# Altium schematic sheet [06] - PROTOCOLS.SchDoc
size A3; DocumentNumber: 4; SheetNumber: 4; SheetTotal: 6
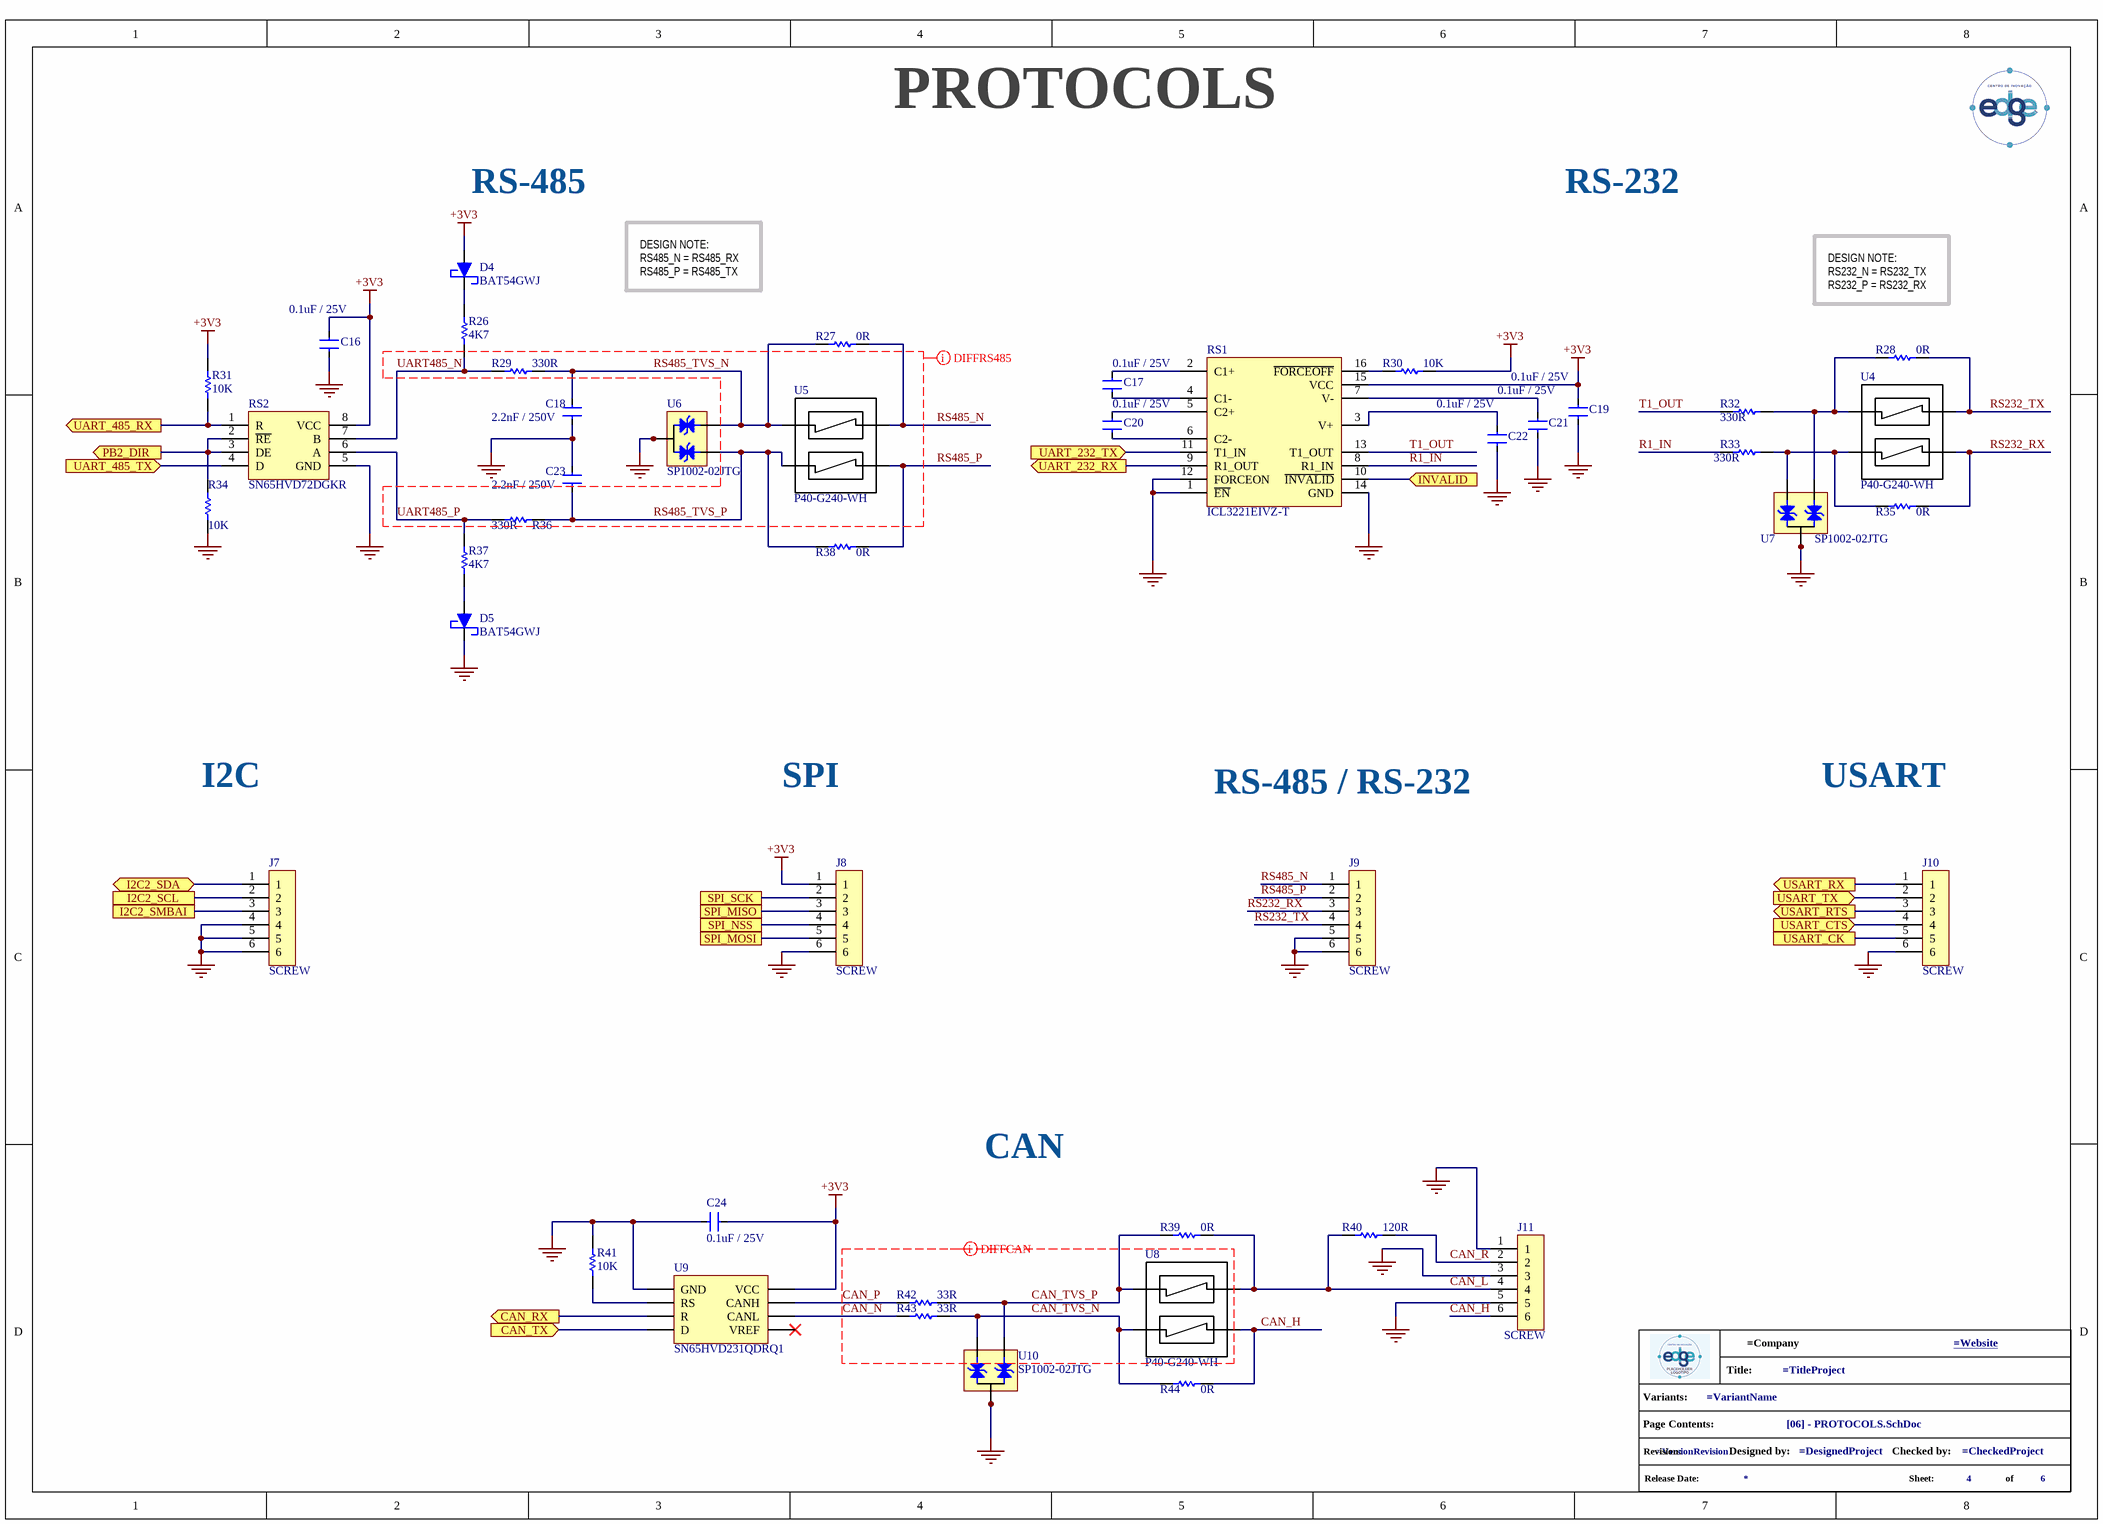
[diagram p0: [06] - PROTOCOLS.SchDoc]

## Parts
*?  info_project  (value not drawn)  (graphical)
C16  0.1uF / 25V  [C0805]
C17  0.1uF / 25V  [C0805]
C18  2.2nF / 250V  [C0805]
C19  0.1uF / 25V  [C0805]
C20  0.1uF / 25V  [C0805]
C21  0.1uF / 25V  [C0805]
C22  0.1uF / 25V  [C0805]
C23  2.2nF / 250V  [C0805]
C24  0.1uF / 25V  [C0805]
D4  BAT54GWJ  [SOD123]
D5  BAT54GWJ  [SOD123]
J7  SCREW  [SCREW-6P]
J8  SCREW  [SCREW-6P]
J9  SCREW  [SCREW-6P]
J10  SCREW  [SCREW-6P]
J11  SCREW  [SCREW-6P]
R26  4K7  [R0805]
R27  0R  [R1206]
R28  0R  [R1206]
R29  330R  [R0805]
R30  10K  [R0805]
R31  10K  [R0805]
R32  330R  [R0805]
R33  330R  [R0805]
R34  10K  [R0805]
R35  0R  [R1206]
R36  330R  [R0805]
R37  4K7  [R0805]
R38  0R  [R1206]
R39  0R  [R1206]
R40  120R  [R0805]
R41  10K  [R0805]
R42  33R  [R0805]
R43  33R  [R0805]
R44  0R  [R1206]
RS1  ICL3221EIVZ-T  [ICL3221E]
RS2  SN65HVD72DGKR  [RS485T]
U4  P40-G240-WH  [TBU - P40-G240-WH]
U5  P40-G240-WH  [TBU - P40-G240-WH]
U6  SP1002-02JTG  [SC705]
U7  SP1002-02JTG  [SC705]
U8  P40-G240-WH  [TBU - P40-G240-WH]
U9  SN65HVD231QDRQ1  [SN65HVD231QDRQ1]
U10  SP1002-02JTG  [SC705]

## Ports
CAN_RX (out), CAN_TX (in), I2C2_SCL, I2C2_SDA (bidir), I2C2_SMBAI, INVALID (in), PB2_DIR (out), SPI_MISO, SPI_MOSI, SPI_NSS, SPI_SCK, UART_232_RX (out), UART_232_TX (in), UART_485_RX (out), UART_485_TX (in), USART_CK, USART_CTS (in), USART_RTS (out), USART_RX (out), USART_TX (in)

## Nets
+3V3: C16.2 C19.1 C24.1 D4.2 J8.1 R30.2 R31.2 RS1.15(VCC) RS2.8(VCC) U9.3(VCC)
GND: C16.1 C18.1 C19.2 C21.2 C22.1 C23.2 C24.2 D5.1 J7.4 J7.5 J7.6 J8.6 J9.5 J9.6 J10.6 J11.1 J11.3 J11.5 R34.1 R41.1 RS1.1(~{EN}) RS1.12(FORCEON) RS1.14(GND) RS2.5(GND) U6.4 U6.5 U7.4 U7.5 U9.2(GND) U10.4 U10.5
CAN_H: J11.6 R44.2 U8.4
CAN_L: J11.4 R39.2 R40.1 U8.3
CAN_N: R43.1 U9.6(CANL)
CAN_P: R42.1 U9.7(CANH)
CAN_R: J11.2 R40.2
CAN_RX: U9.4(R) ; port CAN_RX
CAN_TVS_N: R43.2 R44.1 U8.2 U10.3
CAN_TVS_P: R39.1 R42.2 U8.1 U10.1
CAN_TX: U9.1(D) ; port CAN_TX
I2C2_SCL: J7.2 ; port I2C2_SCL
I2C2_SDA: J7.1 ; port I2C2_SDA
I2C2_SMBAI: J7.3 ; port I2C2_SMBAI
INVALID: RS1.10(~{INVALID}) ; port INVALID
PB2_DIR: R34.2 RS2.2(~{RE}) RS2.3(DE) ; port PB2_DIR
R1_IN: R33.1 RS1.8(R1_IN)
RS232_RX: J9.3 R35.2 U4.4
RS232_TX: J9.4 R28.2 U4.3
RS485_N: J9.1 R27.2 U5.3
RS485_P: J9.2 R38.2 U5.4
RS485_TVS_N: C18.2 R27.1 R29.2 U5.1 U6.3
RS485_TVS_P: C23.1 R36.2 R38.1 U5.2 U6.1
SPI_MISO: J8.3 ; port SPI_MISO
SPI_MOSI: J8.5 ; port SPI_MOSI
SPI_NSS: J8.4 ; port SPI_NSS
SPI_SCK: J8.2 ; port SPI_SCK
T1_OUT: R32.1 RS1.13(T1_OUT)
UART485_N: R26.1 R29.1 RS2.7(B)
UART485_P: R36.1 R37.2 RS2.6(A)
UART_232_RX: RS1.9(R1_OUT) ; port UART_232_RX
UART_232_TX: RS1.11(T1_IN) ; port UART_232_TX
UART_485_RX: R31.1 RS2.1(R) ; port UART_485_RX
UART_485_TX: RS2.4(D) ; port UART_485_TX
USART_CK: J10.5 ; port USART_CK
USART_CTS: J10.4 ; port USART_CTS
USART_RTS: J10.3 ; port USART_RTS
USART_RX: J10.1 ; port USART_RX
USART_TX: J10.2 ; port USART_TX
NetC17_1: C17.1 RS1.4(C1-)
NetC17_2: C17.2 RS1.2(C1+)
NetC20_1: C20.1 RS1.6(C2-)
NetC20_2: C20.2 RS1.5(C2+)
NetC21_1: C21.1 RS1.7(V-)
NetC22_2: C22.2 RS1.3(V+)
NetD4_1: D4.1 R26.2
NetD5_2: D5.2 R37.1
NetR28_1: R28.1 R32.2 U4.1 U7.1
NetR30_1: R30.1 RS1.16(~{FORCEOFF})
NetR33_2: R33.2 R35.1 U4.2 U7.3
NetR41_2: R41.2 U9.8(RS)

Not connected (* = marked no-connect by the designer): U9 5(VREF)*

## Layout directives
differential pair; net class CAN; differential pair class CAN_LINES; differential pair class CAN_TVS_LINES: CAN_N, CAN_P, CAN_TVS_N, CAN_TVS_P
differential pair; net class RS485; differential pair class RS485_LINES; differential pair class RS485_TVS_LINES: RS485_TVS_N, RS485_TVS_P, UART485_N, UART485_P

## Notes on the sheet
- PROTOCOLS
- RS-485
- RS-232
- DESIGN NOTE:
  RS485_N = RS485_RX
  RS485_P = RS485_TX
- DESIGN NOTE:
  RS232_N = RS232_TX
  RS232_P = RS232_RX
- I2C
- SPI
- RS-485 / RS-232
- USART
- CAN
- (in symbol info_project) Title:; Variants:; Page Contents:; Revision:; Designed by:; Checked by:; Release Date:; Sheet:; of

## Library data of the parts
C16 C17 C19-C22 C24 = CC0805KRX7R8BB104: MLCC - 0.1uF 25V 0805 X7R +/- 10%; Manufacturer: Yageo; Material: Ceramic; Capacitance: 100nF; Insulation Resistance: 100GR; Supplier 1: Digi-Key; Manufacturer Part Number: CC0805KRX7R8BB104; RoHS: Yes; Category: Ceramic Capacitors; Stock 1: 331734; Pricing 1: 1=0,12000, 10=0,08800, 50=0,04980, 100=0,04130, 500=0,02894, 1000=0,02396 (USD); Mount: Surface Mount; Case/Package: 0805; Number of Pins: 2; Case Code (Metric): 2012; Case Code (Imperial): 0805; Min Operating Temperature: -55°C; Max Operating Temperature: 125°C; Tolerance: 10%; Dielectric: X7R; Series: CC; Package Quantity: 1; Voltage Rating: 25V; Packaging: Tape and Reel; Voltage Rating (DC): 25V; Termination: SMD/SMT; Resistor Type: Ceramic; Length: 2mm; Width: 0.049inch; Height: 0.85mm; Depth: 1.25mm; Thickness: 0.033inch; Radiation Hardening: No; RoHS Compliant: Yes; REACH SVHC: No SVHC; Lead Free: Lead Free; Halogen Free: Halogen Free; ComponentLink1URL: https://datasheet.ciiva.com/145/mlccorderingcode-145007.pdf?src-supplier=Digi-Key; ComponentLink1Description: https://datasheet.ciiva.com/145/mlccorderingcode-145007.pdf?src-supplier=Digi-Key; ComponentLink2URL: https://datasheet.ciiva.com/145/mlccorderingcode-145008.pdf?src-supplier=Digi-Key; ComponentLink2Description: https://datasheet.ciiva.com/145/mlccorderingcode-145008.pdf?src-supplier=Digi-Key; ComponentLink3URL: https://datasheet.ciiva.com/145/mlccorderingcode-145009.pdf?src-supplier=Digi-Key; ComponentLink3Description: https://datasheet.ciiva.com/145/mlccorderingcode-145009.pdf?src-supplier=Digi-Key; ComponentLink4URL: https://datasheet.ciiva.com/8034/1784427-8034029.pdf?src-supplier=Element14; ComponentLink4Description: https://datasheet.ciiva.com/8034/1784427-8034029.pdf?src-supplier=Element14; ComponentLink5URL: https://datasheet.ciiva.com/8034/1784427-8034030.pdf?src-supplier=Element14; ComponentLink5Description: https://datasheet.ciiva.com/8034/1784427-8034030.pdf?src-supplier=Element14; ComponentLink6URL: https://datasheet.ciiva.com/8034/70765-8034031.pdf?src-supplier=Element14; ComponentLink6Description: https://datasheet.ciiva.com/8034/70765-8034031.pdf?src-supplier=Element14; ComponentLink7URL: https://datasheet.ciiva.com/46430/1850775-46430166.pdf?src-supplier=Element14; ComponentLink7Description: https://datasheet.ciiva.com/46430/1850775-46430166.pdf?src-supplier=Element14; ComponentLink8URL: https://datasheet.ciiva.com/28450/1489800-28450789.pdf?src-supplier=Element14; ComponentLink8Description: https://datasheet.ciiva.com/28450/1489800-28450789.pdf?src-supplier=Element14; ComponentLink9URL: https://datasheet.ciiva.com/15189/getdatasheetpartid-330244-15189223.pdf?src-supplier=Verical; ComponentLink9Description: https://datasheet.ciiva.com/15189/getdatasheetpartid-330244-15189223.pdf?src-supplier=Verical; ComponentLink10URL: https://datasheet.ciiva.com/16625/upy-gphc-x7r-6-3v-to-50v-8-16625546.pdf?src-supplier=Avnet+Europe; ComponentLink10Description: https://datasheet.ciiva.com/16625/upy-gphc-x7r-6-3v-to-50v-8-16625546.pdf?src-supplier=Avnet+Europe; Supplier Part Number 1: 311-1141-1-ND
C18 C23 = C0805C222KAGECAUTO: MLCC - 2.2 nF 250V 0805  C0G +/- 10%; Manufacturer: KEMET; Supplier 1: Digi-Key; Manufacturer Part Number: C0805C222KAGECAUTO; RoHS: Yes; Category: Ceramic Capacitors; Stock 1: 14146; Pricing 1: 1=0,26000, 10=0,17800, 50=0,11880, 100=0,10100, 500=0,07128, 1000=0,06237 (USD); RoHS Compliant: Yes; ComponentLink1URL: https://api.kemet.com/component-edge/download/datasheet/C0805C222KAGECAUTO.pdf?src-supplier=Digi-Key; ComponentLink1Description: https://api.kemet.com/component-edge/download/datasheet/C0805C222KAGECAUTO.pdf?src-supplier=Digi-Key; Supplier Part Number 1: 399-17905-1-ND
D4 D5 = BAT54GWJ: DIODE SCHOTTKY 30 V - 200 mA SOD123; Manufacturer: Nexperia USA; Max Reverse Voltage (DC): 30V; Average Rectified Current: 200mA; Supplier 1: Newark; Manufacturer Part Number: BAT54GWJ; RoHS: No; Mount: Surface Mount; Min Operating Temperature: -40°C; Max Operating Temperature: 85°C; Packaging: Cut Tape; ComponentLink1URL: https://assets.nexperia.com/documents/data-sheet/BAT54GW.pdf?src-supplier=Digi-Key; ComponentLink1Description: https://assets.nexperia.com/documents/data-sheet/BAT54GW.pdf?src-supplier=Digi-Key; Supplier Part Number 1: 73AH9681
J7-J11 = 282834-6: TERM BLK 6P SIDE 2.54MM; Manufacturer: TE Connectivity; Plating: Brass,Steel; Number of Contacts: 6; Current Rating: 10A; Voltage Rating: 150V; Number of Levels: 1; Connector Type: Receptacle; Closed End: No (Without); Screwless Terminal Block: Yes (With); Gender: Female; Wire Gauge (Max): 30AWG; Wire Gauge (Min): 16AWG; Thread Size: M1.6; Tail Length: 3.4mm; Approvals: UL; Supplier 1: Digi-Key; Manufacturer Part Number: 282834-6; RoHS: Yes; Category: Terminal Blocks; Stock 1: 7269; Pricing 1: 1=5,33000, 10=4,06500, 25=3,80720, 50=3,38400, 100=3,31050, 250=3,05300, 500=2,75874, 1000=2,45221 (USD); Mount: Through Hole; Color: Green; Contact Plating: Tin; Contact Material: Brass; Housing Color: Green; Housing Material: Polyamide; Material: Nylon; Min Operating Temperature: -40°C; Max Operating Temperature: 105°C; Termination: Solder; Orientation: Straight; Package Quantity: 100; Packaging: Box; Number of Rows: 1; Series: Buchanan; Number of Positions Per Level: 6; Current: 10A; Voltage: 150V; Number of Positions: 6; Number of Circuits: 6; Max Current Rating: 10A; Interlock: No (Without); Screw Flange: No (Without); Side Stackable: Yes (With); Max Supply Voltage (AC): 150V; Number of Poles: 6; Max Voltage Rating (AC): 150V; Length: 15.7mm; Width: 6.5mm; Pitch: 2.54mm; Depth: 6.5mm; Wire/Cable Gauge: 30AWG; Radiation Hardening: No; Flammability Rating: UL94 V-0; ELV: Compliant; REACH SVHC: Unknown; Lead Free: Lead Free; ComponentLink1URL: https://datasheet.ciiva.com/823/eng-cd-282834-c1-823488.pdf?src-supplier=Digi-Key; ComponentLink1Description: https://datasheet.ciiva.com/823/eng-cd-282834-c1-823488.pdf?src-supplier=Digi-Key; ComponentLink2URL: https://datasheet.ciiva.com/16308/282834-6-16308413.pdf?src-supplier=Future+Electronics; ComponentLink2Description: https://datasheet.ciiva.com/16308/282834-6-16308413.pdf?src-supplier=Future+Electronics; ComponentLink3URL: https://datasheet.ciiva.com/25618/0900766b810c7187-25618156.pdf?src-supplier=RSComponents; ComponentLink3Description: https://datasheet.ciiva.com/25618/0900766b810c7187-25618156.pdf?src-supplier=RSComponents; ComponentLink4URL: https://datasheet.ciiva.com/9370/eng-cs-1308389-eurostyle-terminal-blocks-0607-9370422.pdf?src-supplier=Avnet; ComponentLink4Description: https://datasheet.ciiva.com/9370/eng-cs-1308389-eurostyle-terminal-blocks-0607-9370422.pdf?src-supplier=Avnet; ComponentLink5URL: https://datasheet.ciiva.com/16676/eng-cs-1308389-eurostyle-terminal-blocks-0607-16676062.pdf?src-supplier=Avnet+Europe; ComponentLink5Description: https://datasheet.ciiva.com/16676/eng-cs-1308389-eurostyle-terminal-blocks-0607-16676062.pdf?src-supplier=Avnet+Europe; ComponentLink6URL: https://datasheet.ciiva.com/30097/eng-cs-1308389-eurostyle-terminal-blocks-0607-30097352.pdf?src-supplier=Onlinecomponents.com; ComponentLink6Description: https://datasheet.ciiva.com/30097/eng-cs-1308389-eurostyle-terminal-blocks-0607-30097352.pdf?src-supplier=Onlinecomponents.com; Supplier Part Number 1: A98337-ND
R26 R37 = CRCW08054K70FKEA: RES - 4.7K 1/8W 0805 1%; Manufacturer: Vishay; Resistance: 4.7kR; Power Rating: 125mW; Temperature Coefficient: 100ppm/°C; Voltage Rating: 150V; Supplier 1: RSComponents; Manufacturer Part Number: CRCW08054K70FKEA; RoHS: Yes; Category: Chip SMD Resistors; Stock 1: 1; Pricing 1: 50=0.07500, 250=0.06800, 500=0.05500, 750=0.04400, 1000=0.03700 (USD); Case/Package: 0805; Contact Plating: Tin; Weight: 0.000194oz; Case Code (Imperial): 0805; Case Code (Metric): 2012; Size Code: 0805; Min Operating Temperature: -55°C; Max Operating Temperature: 155°C; Tolerance: 1%; Resistor Type: Thick Film; Termination: SMD/SMT; Packaging: Tape and Reel; Package Quantity: 10; Number of Terminations: 2; Max Power Dissipation: 125mW; Voltage Rating (DC): 150V; Features: Automotive AEC-Q200; Series: CRCW; Resistance Tolerance: 1%; Technology: THICK FILM; Construction: Rectangular; Length: 2mm; Width: 1.25mm; Height: 0.45mm; Depth: 1.25mm; Radiation Hardening: No; Lead Free: Lead Free; RoHS Compliant: Yes; REACH SVHC: Unknown; Military Standard: Not; ComponentLink1URL: https://datasheet.ciiva.com/11808/0900766b80d98b26-11808992.pdf?src-supplier=RSComponents; ComponentLink1Description: https://datasheet.ciiva.com/11808/0900766b80d98b26-11808992.pdf?src-supplier=RSComponents; ComponentLink2URL: https://datasheet.ciiva.com/2467/dcrcwe3-2467437.pdf?src-supplier=Digi-Key; ComponentLink2Description: https://datasheet.ciiva.com/2467/dcrcwe3-2467437.pdf?src-supplier=Digi-Key; ComponentLink3URL: https://datasheet.ciiva.com/2467/dcrcwe3-2467438.pdf?src-supplier=Digi-Key; ComponentLink3Description: https://datasheet.ciiva.com/2467/dcrcwe3-2467438.pdf?src-supplier=Digi-Key; ComponentLink4URL: https://datasheet.ciiva.com/2467/dcrcwe3-2467439.pdf?src-supplier=Digi-Key; ComponentLink4Description: https://datasheet.ciiva.com/2467/dcrcwe3-2467439.pdf?src-supplier=Digi-Key; ComponentLink5URL: https://datasheet.ciiva.com/5550/dcrcwe3-109170-5550903.pdf?src-supplier=Mouser; ComponentLink5Description: https://datasheet.ciiva.com/5550/dcrcwe3-109170-5550903.pdf?src-supplier=Mouser; ComponentLink6URL: https://datasheet.ciiva.com/9071/dcrcwe3-9071196.pdf?src-supplier=Avnet; ComponentLink6Description: https://datasheet.ciiva.com/9071/dcrcwe3-9071196.pdf?src-supplier=Avnet; ComponentLink7URL: https://datasheet.ciiva.com/26317/fld-crcw-e3-data-en-26317145.pdf?src-supplier=Distrelec; ComponentLink7Description: https://datasheet.ciiva.com/26317/fld-crcw-e3-data-en-26317145.pdf?src-supplier=Distrelec; ComponentLink8URL: https://datasheet.ciiva.com/16213/dcrcwe3-16213733.pdf?src-supplier=Future+Electronics; ComponentLink8Description: https://datasheet.ciiva.com/16213/dcrcwe3-16213733.pdf?src-supplier=Future+Electronics; ComponentLink9URL: https://datasheet.ciiva.com/16720/70201119-16720438.pdf?src-supplier=Allied+Electronics; ComponentLink9Description: https://datasheet.ciiva.com/16720/70201119-16720438.pdf?src-supplier=Allied+Electronics; Supplier Part Number 1: 6791496P
R27 R28 R35 R38 R39 R44 = RC1206JR-070RL: RES - 0R 1/4W 1206 5%; Manufacturer: Yageo; Resistance: 0mR; Power Rating: 250mW; Voltage Rating: 200V; Temperature Coefficient: 200ppm/°C; Supplier 1: Digi-Key; Manufacturer Part Number: RC1206JR-070RL; RoHS: Yes; Category: Chip SMD Resistors; Stock 1: 6773822; Pricing 1: 1=0.10000, 10=0.05500, 25=0.04000, 50=0.03040, 100=0.02240, 250=0.01712, 500=0.01368, 1000=0.01007 (USD); Case/Package: 1206; Contact Plating: Tin,Matte; Case Code (Metric): 3216; Case Code (Imperial): 1206; Size Code: 1206; Min Operating Temperature: -55°C; Max Operating Temperature: 155°C; Resistor Type: Thick Film,Carbon Film; Tolerance: 5%; Packaging: Tape and Reel; Package Quantity: 5000; Number of Terminations: 2; Termination: SMD/SMT; Max Power Dissipation: 250mW; Series: RC1206; Resistance Tolerance: 5%; Construction: Rectangular; Technology: THICK FILM; Length: 3.1mm; Width: 0.063inch; Height: 0.026inch; Depth: 1.6mm; Radiation Hardening: No; REACH SVHC: Unknown; Military Standard: Not; Lead Free: Lead Free; RoHS Compliant: Yes; ComponentLink1URL: https://datasheet.ciiva.com/11808/0900766b80c6630a-11808156.pdf?src-supplier=RSComponents; ComponentLink1Description: https://datasheet.ciiva.com/11808/0900766b80c6630a-11808156.pdf?src-supplier=RSComponents; ComponentLink2URL: https://datasheet.ciiva.com/29181/402222-da-01-en-smd-widerstand-0-ohm-1206-29181568.pdf?src-supplier=Conrad; ComponentLink2Description: https://datasheet.ciiva.com/29181/402222-da-01-en-smd-widerstand-0-ohm-1206-29181568.pdf?src-supplier=Conrad; ComponentLink3URL: https://datasheet.ciiva.com/2458/pyu-rc1206-51-rohs-l-4-2458668.pdf?src-supplier=Digi-Key; ComponentLink3Description: https://datasheet.ciiva.com/2458/pyu-rc1206-51-rohs-l-4-2458668.pdf?src-supplier=Digi-Key; ComponentLink4URL: https://datasheet.ciiva.com/2458/pyu-rc1206-51-rohs-l-4-2458669.pdf?src-supplier=Digi-Key; ComponentLink4Description: https://datasheet.ciiva.com/2458/pyu-rc1206-51-rohs-l-4-2458669.pdf?src-supplier=Digi-Key; ComponentLink5URL: https://datasheet.ciiva.com/2458/pyu-rc1206-51-rohs-l-4-2458670.pdf?src-supplier=Digi-Key; ComponentLink5Description: https://datasheet.ciiva.com/2458/pyu-rc1206-51-rohs-l-4-2458670.pdf?src-supplier=Digi-Key; ComponentLink6URL: https://datasheet.ciiva.com/7857/1692832-7857421.pdf?src-supplier=Element14; ComponentLink6Description: https://datasheet.ciiva.com/7857/1692832-7857421.pdf?src-supplier=Element14; ComponentLink7URL: https://datasheet.ciiva.com/17035/pyu-rc1206-51-rohs-l-4-17035512.pdf?src-supplier=Future+Electronics; ComponentLink7Description: https://datasheet.ciiva.com/17035/pyu-rc1206-51-rohs-l-4-17035512.pdf?src-supplier=Future+Electronics; ComponentLink8URL: https://datasheet.ciiva.com/46445/444357-46445719.pdf?src-supplier=Element14; ComponentLink8Description: https://datasheet.ciiva.com/46445/444357-46445719.pdf?src-supplier=Element14; ComponentLink9URL: https://datasheet.ciiva.com/7857/1692832-7857422.pdf?src-supplier=Element14; ComponentLink9Description: https://datasheet.ciiva.com/7857/1692832-7857422.pdf?src-supplier=Element14; ComponentLink10URL: https://datasheet.ciiva.com/7983/444357-7983807.pdf?src-supplier=Element14; ComponentLink10Description: https://datasheet.ciiva.com/7983/444357-7983807.pdf?src-supplier=Element14; ComponentLink11URL: https://datasheet.ciiva.com/22747/1692832-22747541.pdf?src-supplier=Element14; ComponentLink11Description: https://datasheet.ciiva.com/22747/1692832-22747541.pdf?src-supplier=Element14; Supplier Part Number 1: 311-0.0ERCT-ND
R29 R32 R33 R36 = RMCF0805JT330R: RES - 330R 1/8W 0805 5%; Manufacturer: Stackpole Electronics; Power Rating: 125mW; Temperature Coefficient: 200ppm/°C; Supplier 1: Digi-Key; Manufacturer Part Number: RMCF0805JT330R; RoHS: Yes; Category: Chip SMD Resistors; Stock 1: 260111; Pricing 1: 1=0,10000, 10=0,02000, 100=0,00810, 1000=0,00366, 2500=0,00318 (USD); Mount: Surface Mount; Case/Package: 0805; Case Code (Metric): 2012; Case Code (Imperial): 0805; Contact Plating: Tin,Matte; Size Code: 0805; Min Operating Temperature: -55°C; Max Operating Temperature: 155°C; Packaging: Tape and Reel; Resistance: 330R; Tolerance: 5%; Resistor Type: Thick Film; Number of Terminations: 2; Max Power Dissipation: 125mW; Features: Automotive AEC-Q200; Series: RMCF; Construction: Rectangular; Length: 2mm; Width: 0.049inch; Height: 0.026inch; Depth: 1.25mm; Radiation Hardening: No; Military Standard: Not; Lead Free: Lead Free; RoHS Compliant: Yes; ComponentLink1URL: http://components.arrow.com/part/dataview/44988371S7054774N1174?src-supplier=Arrow+Electronics; ComponentLink1Description: http://components.arrow.com/part/dataview/44988371S7054774N1174?src-supplier=Arrow+Electronics; ComponentLink2URL: https://www.seielect.com/catalog/SEI-Packaging.pdf?src-supplier=Digi-Key; ComponentLink2Description: https://www.seielect.com/catalog/SEI-Packaging.pdf?src-supplier=Digi-Key; ComponentLink3URL: https://www.seielect.com/Catalog/SEI-RMCF_RMCP.pdf?src-supplier=Avnet; ComponentLink3Description: https://www.seielect.com/Catalog/SEI-RMCF_RMCP.pdf?src-supplier=Avnet; ComponentLink4URL: https://www.verical.com/server-webapp/html/getDatasheet?partID=360139&src-supplier=Verical; ComponentLink4Description: https://www.verical.com/server-webapp/html/getDatasheet?partID=360139&src-supplier=Verical; ComponentLink5URL: http://www.seielect.com/Catalog/SEI-RMC.pdf?src-supplier=Future+Electronics; ComponentLink5Description: http://www.seielect.com/Catalog/SEI-RMC.pdf?src-supplier=Future+Electronics; Supplier Part Number 1: RMCF0805JT330RCT-ND
R30 R31 R34 R41 = RC0805FR-0710KL: RES - 10K  1/8W 0805 1%; Manufacturer: Yageo; Resistance: 10kR; Temperature Coefficient: 100ppm/°C; Power Rating: 125mW; Voltage Rating: 150V; Supplier 1: Digi-Key; Manufacturer Part Number: RC0805FR-0710KL; RoHS: Yes; Category: Chip SMD Resistors; Stock 1: 5866675; Pricing 1: 1=0,10000, 10=0,04200, 100=0,01690, 1000=0,00759, 2500=0,00659 (USD); Case/Package: 0805; Case Code (Imperial): 0805; Case Code (Metric): 2012; Size Code: 0805; Min Operating Temperature: -55°C; Max Operating Temperature: 155°C; Tolerance: 1%; Resistor Type: Thick Film; Packaging: Tape and Reel; Package Quantity: 1; Termination: SMD/SMT; Number of Terminations: 2; Max Power Dissipation: 125mW; Features: Moisture Resistant; Series: RC; Construction: Rectangular; Resistance Tolerance: 1%; Technology: THICK FILM; Length: 2mm; Width: 0.049inch; Height: 0.024inch; Depth: 1.25mm; REACH SVHC: Unknown; Military Standard: Not; Lead Free: Lead Free; RoHS Compliant: Yes; ComponentLink1URL: https://datasheet.ciiva.com/11808/0900766b8106beab-11808151.pdf?src-supplier=RSComponents; ComponentLink1Description: https://datasheet.ciiva.com/11808/0900766b8106beab-11808151.pdf?src-supplier=RSComponents; ComponentLink2URL: https://datasheet.ciiva.com/12669/rc0805-12669688.pdf?src-supplier=Mouser; ComponentLink2Description: https://datasheet.ciiva.com/12669/rc0805-12669688.pdf?src-supplier=Mouser; ComponentLink3URL: https://datasheet.ciiva.com/2456/pyu-r-int-thick-7-2456974.pdf?src-supplier=Digi-Key; ComponentLink3Description: https://datasheet.ciiva.com/2456/pyu-r-int-thick-7-2456974.pdf?src-supplier=Digi-Key; ComponentLink4URL: https://datasheet.ciiva.com/2456/pyu-r-int-thick-7-2456972.pdf?src-supplier=Digi-Key; ComponentLink4Description: https://datasheet.ciiva.com/2456/pyu-r-int-thick-7-2456972.pdf?src-supplier=Digi-Key; ComponentLink5URL: https://datasheet.ciiva.com/2456/pyu-r-int-thick-7-2456973.pdf?src-supplier=Digi-Key; ComponentLink5Description: https://datasheet.ciiva.com/2456/pyu-r-int-thick-7-2456973.pdf?src-supplier=Digi-Key; ComponentLink6URL: https://datasheet.ciiva.com/16747/rc0805-16747087.pdf?src-supplier=Future+Electronics; ComponentLink6Description: https://datasheet.ciiva.com/16747/rc0805-16747087.pdf?src-supplier=Future+Electronics; ComponentLink7URL: https://datasheet.ciiva.com/46447/444164-46447563.pdf?src-supplier=Element14; ComponentLink7Description: https://datasheet.ciiva.com/46447/444164-46447563.pdf?src-supplier=Element14; Supplier Part Number 1: 311-10.0KCRCT-ND
R40 = RMCF0805JT120R: RES - 120R 1/8W 0805 5%; Manufacturer: Stackpole Electronics; Max Power Dissipation: 125mW; Temperature Coefficient: 200ppm/°C; Supplier 1: Digi-Key; Manufacturer Part Number: RMCF0805JT120R; RoHS: Yes; Category: Chip SMD Resistors; Stock 1: 223393; Pricing 1: 1=0.10000, 10=0.02000, 100=0.00810, 1000=0.00366, 2500=0.00318 (USD); Mount: Surface Mount; Case/Package: 0805; Case Code (Metric): 2012; Case Code (Imperial): 0805; Contact Plating: Tin,Matte; Min Operating Temperature: -55°C; Max Operating Temperature: 155°C; Packaging: Tape and Reel; Resistance: 120R; Tolerance: 5%; Resistor Type: Thick Film; Number of Terminations: 2; Features: Automotive AEC-Q200; Series: RMCF; Construction: Rectangular; Length: 0.079inch; Width: 0.049inch; Height: 0.026inch; Depth: 1.25mm; Radiation Hardening: No; Military Standard: Not; Lead Free: Lead Free; RoHS Compliant: Yes; ComponentLink1URL: https://datasheet.ciiva.com/15193/getdatasheetpartid-409758-15193629.pdf?src-supplier=Verical; ComponentLink1Description: https://datasheet.ciiva.com/15193/getdatasheetpartid-409758-15193629.pdf?src-supplier=Verical; Supplier Part Number 1: RMCF0805JT120RCT-ND
R42 R43 = AC0805FR-0733RL: RES - 33R 1/8W 0805 1%; Manufacturer: Yageo; Power Rating: 125mW; Voltage Rating: 150V; Temperature Coefficient: 100ppm/°C; Supplier 1: Digi-Key; Manufacturer Part Number: AC0805FR-0733RL; RoHS: Yes; Category: Chip SMD Resistors; Stock 1: 4670; Pricing 1: 1=0.10000, 10=0.05000, 100=0.02040, 1000=0.00917, 2500=0.00796 (USD); Case/Package: 0805; Case Code (Imperial): 0805; Case Code (Metric): 2012; Min Operating Temperature: -55°C; Max Operating Temperature: 155°C; Packaging: Tape and Reel; Resistance: 33R; Tolerance: 1%; Resistor Type: Thick Film; Number of Terminations: 2; Termination: SMD/SMT; Max Power Dissipation: 125mW; Features: Moisture Resistant,Automotive AEC-Q200; Series: AC; Length: 0.079inch; Width: 0.049inch; Height: 0.024inch; RoHS Compliant: Yes; ComponentLink1URL: http://www.mouser.com/ds/2/447/yageodocoutput-1111992.pdf?src-supplier=Mouser; ComponentLink1Description: http://www.mouser.com/ds/2/447/yageodocoutput-1111992.pdf?src-supplier=Mouser; ComponentLink2URL: http://www.yageo.com/NewPortal/yageodocoutput?fileName=/pdf/R-Chip/PYu-AC_51_RoHS_L_6.pdf&src-supplier=Digi-Key; ComponentLink2Description: http://www.yageo.com/NewPortal/yageodocoutput?fileName=/pdf/R-Chip/PYu-AC_51_RoHS_L_6.pdf&src-supplier=Digi-Key; ComponentLink3URL: http://www.yageo.com/NewPortal/yageodocoutput?fileName=/pdf/R-Chip/PYu-AC_51_RoHS_L_5.pdf&src-supplier=Digi-Key; ComponentLink3Description: http://www.yageo.com/NewPortal/yageodocoutput?fileName=/pdf/R-Chip/PYu-AC_51_RoHS_L_5.pdf&src-supplier=Digi-Key; Supplier Part Number 1: YAG5367CT-ND
RS1 = ICL3221EIVZ-T: RS-232 TRANSCEIVER 16-Pin TSSOP; Manufacturer: Renesas; Supplier 1: Digi-Key; Manufacturer Part Number: ICL3221EIVZ-T; RoHS: Yes; Category: RS-232 / RS-422 / RS-485 Interface ICs; Stock 1: 4298; Pricing 1: 1=1,56000, 10=1,40400, 25=1,32480, 100=1,12890, 250=1,06000, 500=0,92750, 1000=0,83500 (USD); RoHS Compliant: Yes; ComponentLink1URL: https://4donline.ihs.com/images/VipMasterIC/IC/RNCC/RNCC-S-A0008369024/RNCC-S-A0008369024-1.pdf?hkey=6D3A4C79FDBF58556ACFDE234799DDF0&src-supplier=Farnell; ComponentLink1Description: https://4donline.ihs.com/images/VipMasterIC/IC/RNCC/RNCC-S-A0008369024/RNCC-S-A0008369024-1.pdf?hkey=6D3A4C79FDBF58556ACFDE234799DDF0&src-supplier=Farnell; ComponentLink2URL: https://4donline.ihs.com/images/VipMasterIC/IC/RNCC/RNCC-S-A0008369024/RNCC-S-A0008369024-1.pdf?hkey=6D3A4C79FDBF58556ACFDE234799DDF0&src-supplier=Newark; ComponentLink2Description: https://4donline.ihs.com/images/VipMasterIC/IC/RNCC/RNCC-S-A0008369024/RNCC-S-A0008369024-1.pdf?hkey=6D3A4C79FDBF58556ACFDE234799DDF0&src-supplier=Newark; Supplier Part Number 1: ICL3221EIVZ-TCT-ND
RS2 = SN65HVD72DGKR: RS-485 TRANSCEIVER HVD7X; Manufacturer: Texas Instruments; Number of Receivers: 1; Operating Supply Voltage: 3.3V; Min Supply Voltage: 3V; Max Supply Voltage: 3.6V; Nominal Supply Current: 950uA; Output Current: 8mA; Output Voltage: 2V; Propagation Delay: 0.7us; Data Rate: 0.25Mbps; Simplex/Duplex: Half Duplex; Supplier 1: Digi-Key; Manufacturer Part Number: SN65HVD72DGKR; RoHS: Yes; Category: Interface ICs; Pricing 1: 1=4,03000 (USD); Case/Package: VSSOP; Number of Pins: 8; Min Operating Temperature: -40°C; Max Operating Temperature: 125°C; Number of Transmitters: 1; Package Quantity: 2500; Interface: RS-485; Packaging: Tape and Reel; Logic Function: Transceiver; Number of Drivers: 1; Number of Transceivers: 1; Supply Current: 950uA; Series: -; Radiation Hardening: No; REACH SVHC: No SVHC; Lead Free: Lead Free; ComponentLink1URL: https://datasheet.ciiva.com/28650/1787953-28650706.pdf?src-supplier=Element14; ComponentLink1Description: https://datasheet.ciiva.com/28650/1787953-28650706.pdf?src-supplier=Element14; ComponentLink2URL: https://datasheet.ciiva.com/26946/getdatasheetpartid-716725-26946073.pdf?src-supplier=Verical; ComponentLink2Description: https://datasheet.ciiva.com/26946/getdatasheetpartid-716725-26946073.pdf?src-supplier=Verical; ComponentLink3URL: https://datasheet.ciiva.com/41461/001187608-da-01-en-ic-txrx-rs485-sn65hvd72dgkr-vssop-8-tid-41461063.pdf?src-supplier=Conrad; ComponentLink3Description: https://datasheet.ciiva.com/41461/001187608-da-01-en-ic-txrx-rs485-sn65hvd72dgkr-vssop-8-tid-41461063.pdf?src-supplier=Conrad; ComponentLink4URL: https://datasheet.ciiva.com/6636/sn65hvd72-6636345.pdf?src-supplier=Digi-Key; ComponentLink4Description: https://datasheet.ciiva.com/6636/sn65hvd72-6636345.pdf?src-supplier=Digi-Key; ComponentLink5URL: https://datasheet.ciiva.com/6636/sn65hvd72-6636346.pdf?src-supplier=Digi-Key; ComponentLink5Description: https://datasheet.ciiva.com/6636/sn65hvd72-6636346.pdf?src-supplier=Digi-Key; ComponentLink6URL: https://datasheet.ciiva.com/6636/sn65hvd72-6636347.pdf?src-supplier=Digi-Key; ComponentLink6Description: https://datasheet.ciiva.com/6636/sn65hvd72-6636347.pdf?src-supplier=Digi-Key; ComponentLink7URL: https://datasheet.ciiva.com/14195/sn65hvd75-14195211.pdf?src-supplier=Avnet; ComponentLink7Description: https://datasheet.ciiva.com/14195/sn65hvd75-14195211.pdf?src-supplier=Avnet; ComponentLink8URL: https://datasheet.ciiva.com/24096/sn65hvd72-446416-24096821.pdf?src-supplier=Mouser; ComponentLink8Description: https://datasheet.ciiva.com/24096/sn65hvd72-446416-24096821.pdf?src-supplier=Mouser; Supplier Part Number 1: 296-SN65HVD72DGKRCT-ND
U4 U5 U8 = P40-G240-WH: TBU 240MA 40VIMP; Manufacturer: Bourns; Number of Terminals/Pins: 6; Working Voltage: 28V; Number of Circuits: 2; Voltage Rating: 40V; Output Current: 480mA; Quiescent Current: 700uA; Response Time: 200ns; Approvals: UL; Supplier 1: Digi-Key; Manufacturer Part Number: P40-G240-WH; RoHS: Yes; Category: Circuit Protection; Stock 1: 7844; Pricing 1: 1=1.42000, 10=1.26600, 100=0.98670, 500=0.81510, 1000=0.64350 (USD); Mount: Surface Mount; Case/Package: DFN; Number of Pins: 6; Min Operating Temperature: -40°C; Max Operating Temperature: 85°C; Package Quantity: 3000; Packaging: Tape and Reel; Series: TBU®; Current Rating: 240mA; Max Surge Current: 240mA; Max Output Current: 480mA; Termination: SMD/SMT; Voltage Rating (DC): 28V; Length: 4mm; Width: 4mm; Height: 0.85mm; Depth: 4.1mm; REACH SVHC: No SVHC; RoHS Compliant: Yes; ComponentLink1URL: https://datasheet.ciiva.com/329/p40-g-329718.pdf?src-supplier=Digi-Key; ComponentLink1Description: https://datasheet.ciiva.com/329/p40-g-329718.pdf?src-supplier=Digi-Key; ComponentLink2URL: https://datasheet.ciiva.com/4503/p40-g-69647-4503607.pdf?src-supplier=Mouser; ComponentLink2Description: https://datasheet.ciiva.com/4503/p40-g-69647-4503607.pdf?src-supplier=Mouser; ComponentLink3URL: https://datasheet.ciiva.com/1290/337271-1290116.pdf?src-supplier=Element14; ComponentLink3Description: https://datasheet.ciiva.com/1290/337271-1290116.pdf?src-supplier=Element14; ComponentLink4URL: https://datasheet.ciiva.com/329/p40-g-329719.pdf?src-supplier=Digi-Key; ComponentLink4Description: https://datasheet.ciiva.com/329/p40-g-329719.pdf?src-supplier=Digi-Key; ComponentLink5URL: https://datasheet.ciiva.com/329/p40-g-329720.pdf?src-supplier=Digi-Key; ComponentLink5Description: https://datasheet.ciiva.com/329/p40-g-329720.pdf?src-supplier=Digi-Key; ComponentLink6URL: https://datasheet.ciiva.com/3011/p40-g-3011993.pdf?src-supplier=Avnet; ComponentLink6Description: https://datasheet.ciiva.com/3011/p40-g-3011993.pdf?src-supplier=Avnet; Supplier Part Number 1: P40-G240-WHCT-ND
U6 U7 U10 = SP1002-02JTG: DIODE TVS ESD VRWM - 6V / VBR - 8V / VC - 16V; Manufacturer: Littelfuse; Direction: Bidirectional; Capacitance: 5pF; Number of Channels: 2; Max Surge Current: 2A; Clamping Voltage: 11.2V; Power Line Protection: No; Number of Elements: 1; Test Current: 10mA; Leakage Current: 500nA; Diode Type: ZENER; Supplier 1: Digi-Key; Manufacturer Part Number: SP1002-02JTG; RoHS: Yes; Category: TVS Diodes; Stock 1: 29509; Pricing 1: 1=0.44000, 10=0.37700, 100=0.28150, 500=0.22118, 1000=0.17092 (USD); Mount: Surface Mount; Case/Package: SC; Number of Pins: 5; Min Operating Temperature: -40°C; Max Operating Temperature: 85°C; Packaging: Tape and Reel; Reverse Breakdown Voltage: 6V; Number of Bidirectional Channels: 2; Reverse Standoff Voltage: 6V; Min Breakdown Voltage: 8V; Polarity: Bidirectional; Breakdown Voltage: 6V; Termination: SMD/SMT; Working Voltage: 6V; Peak Pulse Current: 2A; Resistor Type: Zener; Series: SP1002, SPA®; Clamping Voltage-Max: 16V; Length: 2.25mm; Width: 1.35mm; Height: 1mm; REACH SVHC: Unknown; Lead Free: Lead Free; RoHS Compliant: Yes; ComponentLink1URL: https://datasheet.ciiva.com/4509/littelfuse-spa-sp1002-0x-41082-4509048.pdf?src-supplier=Mouser; ComponentLink1Description: https://datasheet.ciiva.com/4509/littelfuse-spa-sp1002-0x-41082-4509048.pdf?src-supplier=Mouser; ComponentLink2URL: https://datasheet.ciiva.com/6578/littelfuse-tvs-diode-array-sp1002-datasheet-pdf-6578325.pdf?src-supplier=Digi-Key; ComponentLink2Description: https://datasheet.ciiva.com/6578/littelfuse-tvs-diode-array-sp1002-datasheet-pdf-6578325.pdf?src-supplier=Digi-Key; ComponentLink3URL: https://datasheet.ciiva.com/16488/littelfuse-spa-sp1002-0x-16488470.pdf?src-supplier=Future+Electronics; ComponentLink3Description: https://datasheet.ciiva.com/16488/littelfuse-spa-sp1002-0x-16488470.pdf?src-supplier=Future+Electronics; Supplier Part Number 1: F4238CT-ND
U9 = SN65HVD231QDRQ1: CAN TRANSCEIVER - 1/1 - 3.3V; Manufacturer: Texas Instruments; Data Rate: 1Mbps; Max Supply Voltage: 3.6V; Min Supply Voltage: 3V; Nominal Supply Current: 17mA; Number of Receive Buffers: 1; Supplier 1: Digi-Key; Manufacturer Part Number: SN65HVD231QDRQ1; RoHS: Yes; Category: Interface ICs; Stock 1: 4145; Pricing 1: 1=3,14000, 10=2,82000, 25=2,66640, 100=2,31090, 250=2,19240, 500=1,96724, 1000=1,95650 (USD); Case/Package: D; Number of Pins: 8; Weight: 0.002561oz; Contact Plating: Gold; Min Operating Temperature: -40°C; Max Operating Temperature: 125°C; Operating Supply Voltage: 3.3V; Packaging: Tape and Reel; Package Quantity: 1; Number of Transmit Buffers: 1; Number of Transceivers: 1; Max Supply Current: 17mA; Number of Drivers: 1; Number of Receivers: 1; Series: -; Supply Current: 17mA; Radiation Hardening: No; REACH SVHC: No SVHC; Lead Free: Lead Free; RoHS Compliant: Yes; ComponentLink1URL: https://datasheet.ciiva.com/26831/sn65hvd231qdrq1-26831798.pdf?src-supplier=IIIC; ComponentLink1Description: https://datasheet.ciiva.com/26831/sn65hvd231qdrq1-26831798.pdf?src-supplier=IIIC; ComponentLink2URL: https://datasheet.ciiva.com/1766/sn65hvd230q-q1-1766618.pdf?src-supplier=Digi-Key; ComponentLink2Description: https://datasheet.ciiva.com/1766/sn65hvd230q-q1-1766618.pdf?src-supplier=Digi-Key; ComponentLink3URL: https://datasheet.ciiva.com/1766/sn65hvd230q-q1-1766619.pdf?src-supplier=Digi-Key; ComponentLink3Description: https://datasheet.ciiva.com/1766/sn65hvd230q-q1-1766619.pdf?src-supplier=Digi-Key; ComponentLink4URL: https://datasheet.ciiva.com/1766/sn65hvd230q-q1-1766620.pdf?src-supplier=Digi-Key; ComponentLink4Description: https://datasheet.ciiva.com/1766/sn65hvd230q-q1-1766620.pdf?src-supplier=Digi-Key; ComponentLink5URL: https://datasheet.ciiva.com/14424/sn65hvd232q-q1-14424394.pdf?src-supplier=Avnet; ComponentLink5Description: https://datasheet.ciiva.com/14424/sn65hvd232q-q1-14424394.pdf?src-supplier=Avnet; ComponentLink6URL: https://datasheet.ciiva.com/15150/getdatasheetpartid-373997-15150022.pdf?src-supplier=Verical; ComponentLink6Description: https://datasheet.ciiva.com/15150/getdatasheetpartid-373997-15150022.pdf?src-supplier=Verical; ComponentLink7URL: https://datasheet.ciiva.com/1598/1818609-1598776.pdf?src-supplier=Newark; ComponentLink7Description: https://datasheet.ciiva.com/1598/1818609-1598776.pdf?src-supplier=Newark; Supplier Part Number 1: 296-15380-1-ND